# EAGLE design CarDelayRelay (EAGLE 6.4)
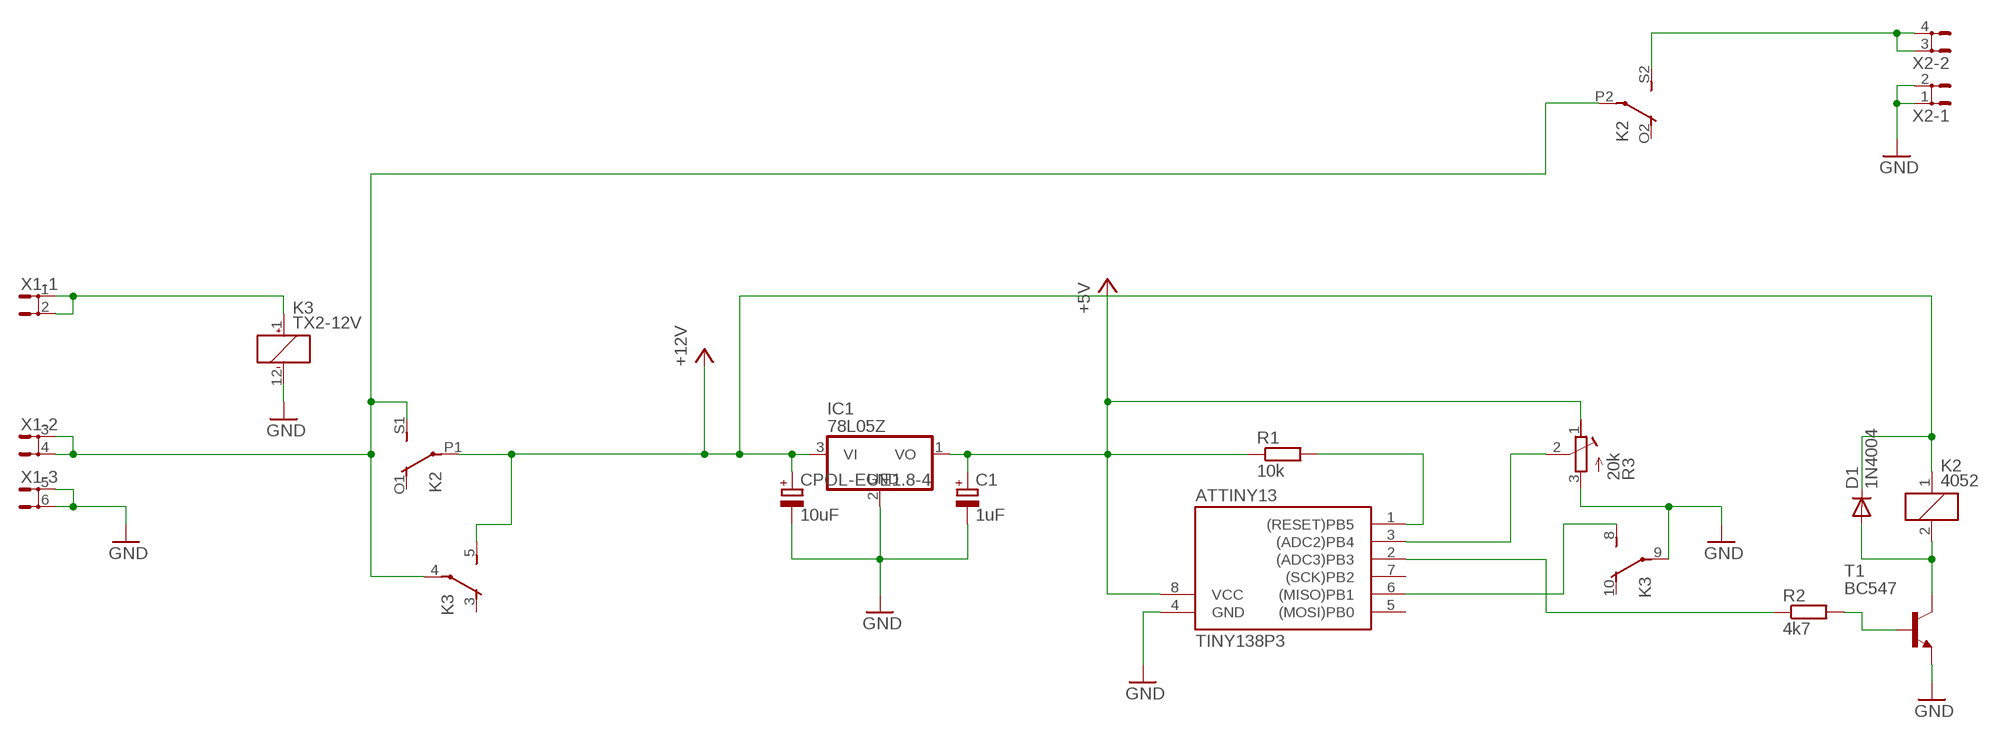
[diagram p0: schematic, sheet 1]

## Parts
ATTINY13  TINY138P3  [DIL08]
C1  1uF  CPOL-EUE1.8-4  [E1,8-4]
CPOL-EUE1.8-4  10uF  CPOL-EUE1.8-4  [E1,8-4]
D1  1N4004  [DO41-10]
IC1  78L05Z  [TO92]
K2  4052  [F4052]
K3  TX2-12V  [TX2]
R1  10k  R-EU_0204/7  [0204/7]
R2  4k7  R-EU_0207/2V  [0207/2V]
R3  20k  R-TRIMM43P  [RTRIM43P]
T1  BC547  [TO92]
X1  SH5-3  [SH5-3]
X2  SH5-2  [SH5-2]

## Nets
+5V: ATTINY13.8(VCC) C1.+ IC1.1(VO) R1.1 R3.1(A)
GND: ATTINY13.4(GND) C1.- CPOL-EUE1.8-4.- IC1.2(GND) K3.9(2:P) K3.12(_:-) R3.3(E) T1.1(E) X1.5 X1.6 X2.1 X2.2
IC1: ATTINY13.6((MISO)PB1) K3.8(2:S)
N$1: K3.1(_:+) X1.1 X1.2
N$3: ATTINY13.1((RESET)PB5) R1.2
N$4: ATTINY13.2((ADC3)PB3) R2.1
N$5: R2.2 T1.2(B)
N$6: D1.A K2.2 T1.3(C)
N$7: K2.P2(3:P) K2.S1(2:S) K3.4(1:P) X1.3 X1.4
N$11: K2.S2(3:S) X2.3 X2.4
N$13: ATTINY13.3((ADC2)PB4) R3.2(S)
VCC: CPOL-EUE1.8-4.+ D1.C IC1.3(VI) K2.1 K2.P1(2:P) K3.5(1:S) ; supply symbol labelled +12V
Unconnected: ATTINY13.5((MOSI)PB0) ATTINY13.7((SCK)PB2) K2.O1(2:O) K2.O2(3:O) K3.3(1:O) K3.10(2:O)

## Library data of the parts
ATTINY13 = 0_avr:TINY13*
C1 CPOL-EUE1.8-4 = 0_Standard-Parts:CPOL-EU: POLARIZED CAPACITOR, European symbol
D1 = diode:1N4004: DIODE general purpose rectifier, 1 A
IC1 = linear:78*: Positive VOLTAGE REGULATOR Source: http://cache.national.com/ds/LM/LM78L05.pdf http://www.fairchildsemi.com/ds/LM/LM7805.pdf
K2 = Relay:4052: RELAY 2 x switch, Finder; OC_FARNELL: unknown; OC_NEWARK: unknown
K3 = Relay:TX2?-*: 2 AMP. HIGH CAPACITY RELAY NAiS WITH HIGH SURGE VOLTAGE & HIGH BREAKDOWN VOLTAGE Source: http://www.mew-europe.com/.. en_ds_61022_0001.pdf; MF: AROMAT/ MATSUSHITA; MPN: TX2-12V; OC_FARNELL: 1200952; OC_NEWARK: 67K1295
R1 R2 = 0_Standard-Parts:R-EU_: RESISTOR, European symbol
R3 = 0_Standard-Parts:R-TRIMM: Trimm resistor
T1 = transistor:BC547: NPN TRANSISTOR
X1 = con-rib:SH5-3: RIBBON CABLE CONNECTOR Flachstecker / Faston; OC_FARNELL: unknown; OC_NEWARK: unknown
X2 = con-rib:SH5-2: RIBBON CABLE CONNECTOR Flachstecker / Faston; OC_FARNELL: unknown; OC_NEWARK: unknown

## Board
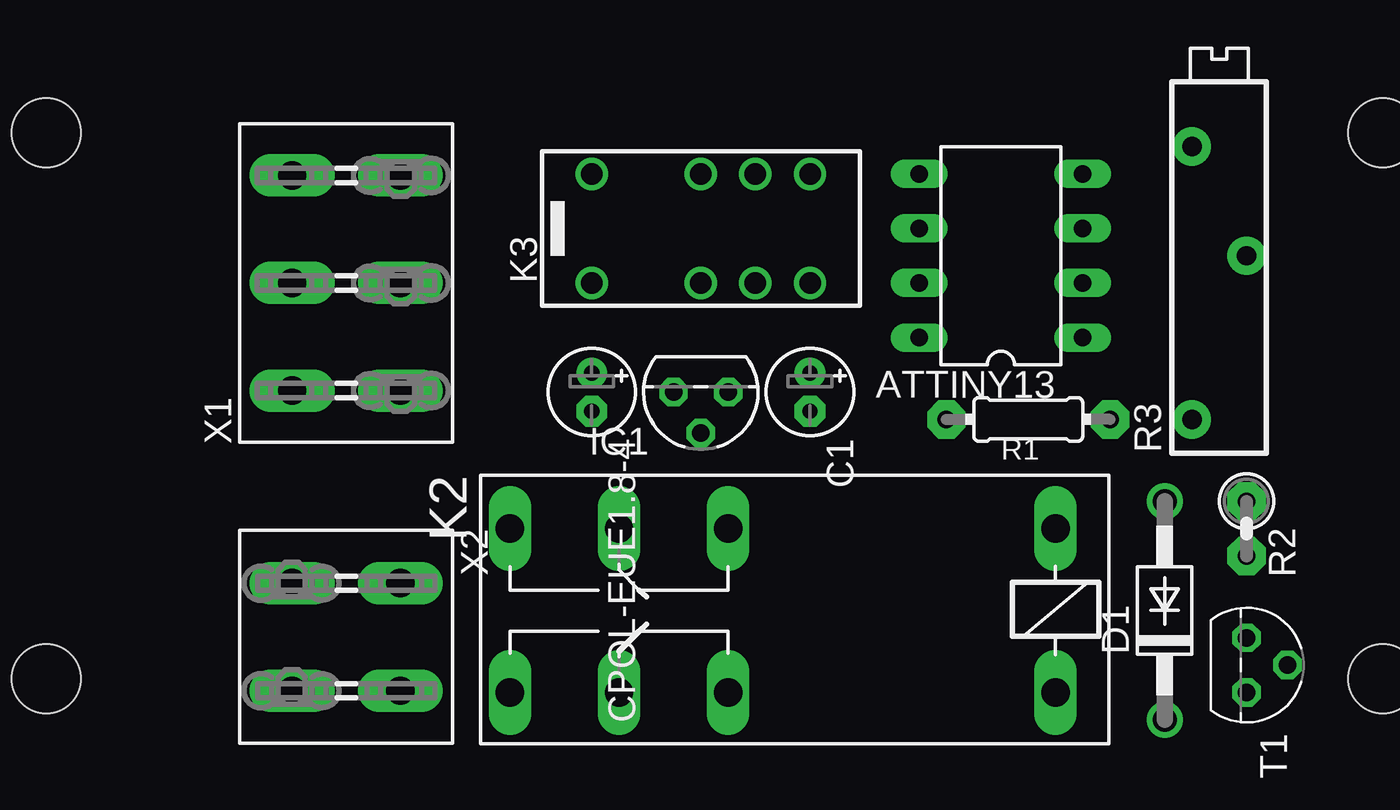
[diagram p1: board, top side]
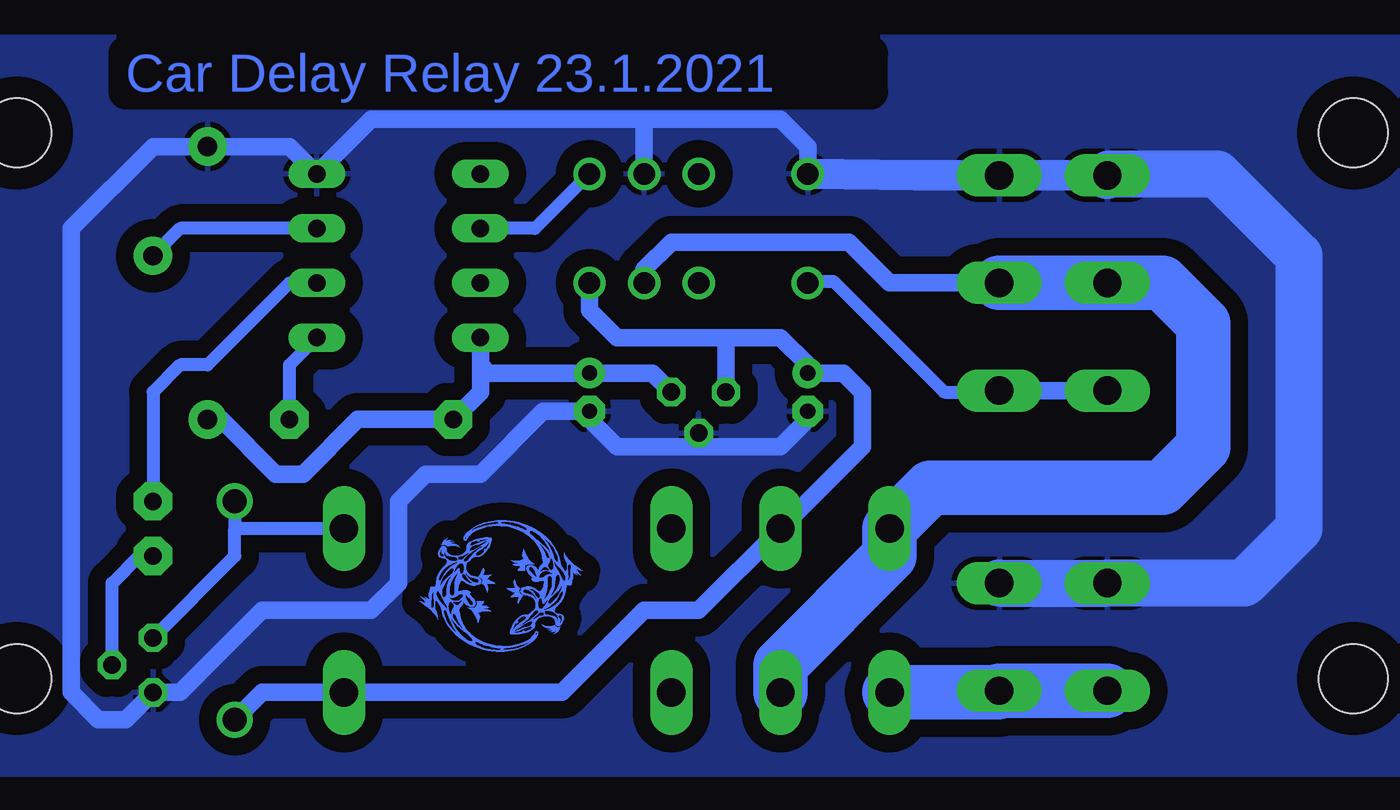
[diagram p2: board, bottom side, seen from below]

No outline drawn. Coordinates in mm, seen from the top.
Copper layers (1*16): layer 1 0.035mm / dielectric 1.5mm / Bottom 0.035mm
Design rules "default": minimum track width 10mil, minimum drill 24mil, track to track 8mil, track to pad 8mil, pad to pad 8mil, via to via 8mil, smd to smd 8mil, copper to edge 40mil, drill to drill 8mil, minimum pad ring 10mil, minimum via ring 8mil, stop-mask expansion 4mil, vias tented up to drill 0mil, thermal gap 10mil
Holes 3.2 mm at 3.81,29.84 3.81,4.45 66.04,29.84 66.04,4.45

### Footprints (pad centres in the part's own frame; a part is rotated, then mirrored left to right if it is on the bottom)
DIL08 = drill 0.813 long: 1 -3.81,-3.81; 2 -1.27,-3.81; 3 1.27,-3.81; 4 3.81,-3.81; 5 3.81,3.81; 6 1.27,3.81; 7 -1.27,3.81; 8 -3.81,3.81
E1,8-4 = drill 0.711 pad 1.422: + -0.889,0 | drill 0.711 pad 1.422 octagon: - 0.889,0
DO41-10 = drill 1.118: A 5.08,0; C -5.08,0
TO92 = drill 0.813 octagon: 1 -1.27,0; 2 0,1.905; 3 1.27,0
F4052 = drill 1.321 long: 1 -3.81,3.81; 2 -3.81,-3.81; O1 11.43,-3.81; O2 11.43,3.81; P1 16.51,-3.81; P2 16.51,3.81; S1 21.59,-3.81; S2 21.59,3.81
TX2 = drill 1: 1 -5.08,-2.54; 3 0,-2.54; 4 2.54,-2.54; 5 5.08,-2.54; 8 5.08,2.54; 9 2.54,2.54; 10 0,2.54; 12 -5.08,2.54
0204/7 = drill 0.813 pad 1.778 octagon: 1 -3.81,0; 2 3.81,0
0207/2V = drill 0.813 pad 1.778 octagon: 1 -1.27,0; 2 1.27,0
RTRIM43P = drill 0.9 pad 1.778: 1 -7.62,1.27; 2 0,-1.27; 3 5.08,1.27
TO92' = drill 0.813 octagon: 1 1.27,0; 2 0,1.905; 3 -1.27,0
SH5-3 = drill 1.321 long: 1 -5.004,-2.515; 2 -5.004,2.515; 3 0,-2.515; 4 0,2.515; 5 5.004,-2.515; 6 5.004,2.515
SH5-2 = drill 1.321 long: 1 0,-2.515; 2 0,2.515; 3 5.004,-2.515; 4 5.004,2.515

### Placement (x,y rotation side)
ATTINY13  48.26,24.13 90 top
C1  39.37,17.78 270 top
CPOL-EUE1.8-1  [BOTTOM_DOUBLE_LIZARD_300]  40.01,5.71 0 top
CPOL-EUE1.8-4  29.21,17.78 270 top
D1  55.88,7.62 90 top
IC1  34.29,17.78 180 top
K2  46.99,7.62 180 top
K3  34.29,25.4 0 top
R1  49.53,16.51 0 top
R2  59.69,11.43 270 top
R3  58.42,24.13 90 top
T1  BC547  [TO92']  59.69,5.08 270 top
X1  17.78,22.86 90 top
X2  17.78,8.89 270 top

### Tracks (layer width: path | path; a pad name or v marks a point on that pad's centre or on a via)
+5V
  Bottom 0.813: IC1.1 36.45,18.67 C1.+ 44.07,18.67 44.45,19.05 | ATTINY13.8 44.45,19.05 | 44.45,19.05 44.45,17.78 R1.1 50.16,16.51 52.7,13.97 53.98,13.97 56.52,16.51 R3.1
GND
  Bottom 0.813: K3.9 36.83,30.48 | 36.83,30.48 30.48,30.48 29.21,29.21 K3.12 | 34.29,15.24 38.1,15.24 39.37,16.51 C1.- 41.53,16.89 44.45,13.97 46.99,13.97 48.26,12.7 48.26,8.89 49.53,7.62 54.61,7.62 58.42,3.81 T1.1 60.96,2.54 62.23,2.54 63.5,3.81 63.5,25.4 59.69,29.21 R3.3 53.34,29.21 ATTINY13.4 49.53,30.48 36.83,30.48 | 34.29,15.24 IC1.2 | CPOL-EUE1.8-4.- 29.21,16.51 30.48,15.24 34.29,15.24
  Bottom 1.422: X1.6 X1.5 24.21,27.86 K3.12
  Bottom 2.184: X2.2 X2.1 8.89,8.89 6.35,11.43 6.35,24.13 10.16,27.94 15.19,27.94 X1.6
  pour Bottom (isolate 0.813): 69.85,0 0,0 0,34.29 69.85,34.29
IC1
  Bottom 0.61: K3.8 41.91,25.4 ATTINY13.6
N$1
  Bottom 0.61: 29.13,22.94 28.02,22.94 22.86,17.78 20.37,17.78 X1.1
  Bottom 0.813: X1.2 X1.1 | 29.13,22.94 K3.1
N$3
  Bottom 0.61: R1.2 53.34,19.05 ATTINY13.1
N$4
  Bottom 0.61: ATTINY13.2 53.34,22.86 57.15,19.05 58.42,19.05 59.69,17.78 R2.1
N$5
  Bottom 0.61: T1.2 61.59,8.89 60.33,10.16 R2.2
N$6
  Bottom 0.61: K2.2 55.88,11.43 | D1.A 55.88,11.43 | T1.3 55.88,10.16 55.88,11.43
N$7
  Bottom 0.813: X1.3 25.4,22.86 27.3,24.77 35.56,24.77 36.83,23.5 K3.4
  Bottom 2.54: X1.3 X1.4 12.7,22.86 10.79,20.95 10.79,15.24 12.7,13.34 23.5,13.34 K2.S1 25.4,10.16 30.48,5.08 K2.P2
N$11
  Bottom 2.184: 20.37,3.81 X2.4
  Bottom 2.54: X2.3 X2.4 | K2.S2 20.37,3.81
N$13
  Bottom 0.61: ATTINY13.3 58.42,25.4 R3.2
VCC
  Bottom 0.813: K3.5 39.37,21.59 38.1,20.32 33.02,20.32 | 33.02,20.32 30.48,20.32 29.21,19.05 CPOL-EUE1.8-4.+ 27.56,18.67 26.67,17.78 26.67,15.24 K2.P1 34.29,7.62 36.83,7.62 40.64,3.81 K2.1 54.61,3.81 D1.C | IC1.3 33.02,20.32

### Text on the board
Bottom: Car Delay Relay 23.1.2021
tDocu: GND | 12V | 12V Sense | GND Out | 12V Out